# Altium schematic sheet DISPLAY.SchDoc
size A; SheetNumber: 3; SheetTotal: 7
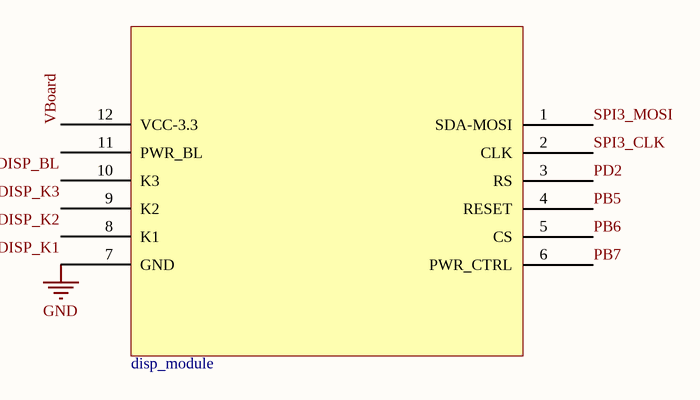
[diagram p0: DISPLAY.SchDoc]

## Parts
disp_module  connector  [abr_oled13_3key_module_2d]  (value not drawn)

## Nets
GND: disp_module.7(GND)
DISP_BL: disp_module.11(PWR_BL)
DISP_K1: disp_module.8(K1)
DISP_K2: disp_module.9(K2)
DISP_K3: disp_module.10(K3)
PB5: disp_module.4(RESET)
PB6: disp_module.5(CS)
PB7: disp_module.6(PWR_CTRL)
PD2: disp_module.3(RS)
SPI3_CLK: disp_module.2(CLK)
SPI3_MOSI: disp_module.1(SDA-MOSI)
VBoard: disp_module.12(VCC-3.3)

## Library data of the parts
disp_module = abr_tft13_3key_disp